# Altium project fmuvxX-baseT1.PrjPCB (part 3 of 3)

## Sheet 10_ethernet.SchDoc: =Proj_Title
size B; Date: 05/11/2022; CheckedBy: David Sidrane; Author: Dugan Yoon; Organization: © 2022 NXP; Address1: Giesshuebelstrasse 40; Address2: 8045 Zurich, Switzerland; DocumentNumber: 725001; Revision: 01; SheetNumber: 10; SheetTotal: 11
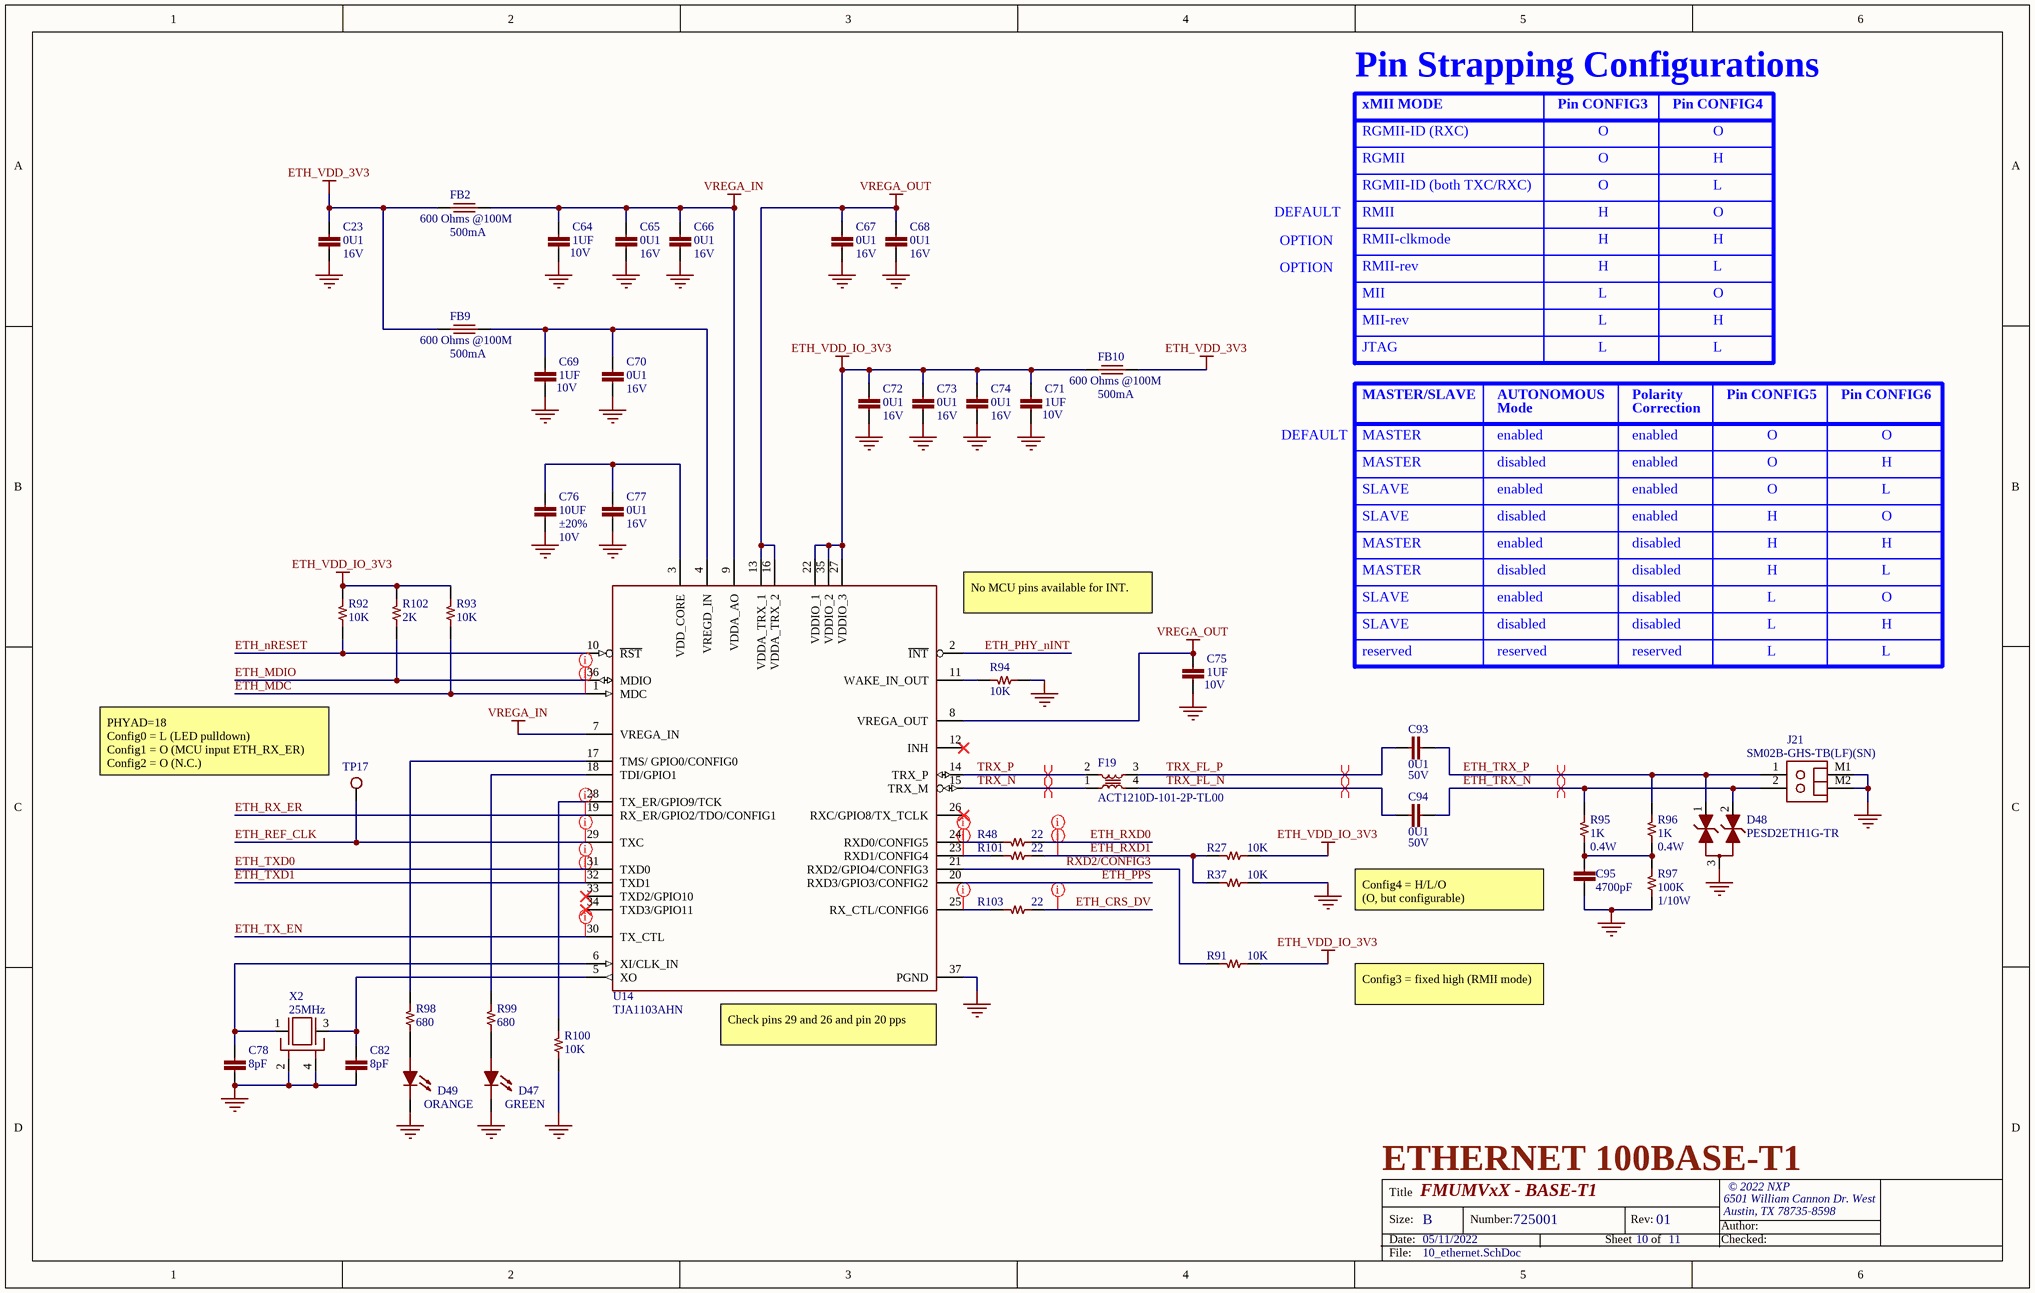
[diagram p6: 10_ethernet.SchDoc]

### Parts
C23  value 0U1  Voltage - Rated: 16V  [CAPC100X50X56L25N]  (hidden comment: CAP CER 0.1UF 10% 16V X7R 0402)
C64  value 1UF  Voltage - Rated: 10V  [CAPC100X50X56L25N]  (hidden comment: CAP CER 1UF 20% 10V X5R 0402)
C65  value 0U1  Voltage - Rated: 16V  [CAPC100X50X56L25N]  (hidden comment: CAP CER 0.1UF 10% 16V X7R 0402)
C66  value 0U1  Voltage - Rated: 16V  [CAPC100X50X56L25N]  (hidden comment: CAP CER 0.1UF 10% 16V X7R 0402)
C67  value 0U1  Voltage - Rated: 16V  [CAPC100X50X56L25N]  (hidden comment: CAP CER 0.1UF 10% 16V X7R 0402)
C68  value 0U1  Voltage - Rated: 16V  [CAPC100X50X56L25N]  (hidden comment: CAP CER 0.1UF 10% 16V X7R 0402)
C69  value 1UF  Voltage - Rated: 10V  [CAPC100X50X56L25N]  (hidden comment: CAP CER 1UF 20% 10V X5R 0402)
C70  value 0U1  Voltage - Rated: 16V  [CAPC100X50X56L25N]  (hidden comment: CAP CER 0.1UF 10% 16V X7R 0402)
C71  value 1UF  Voltage - Rated: 10V  [CAPC100X50X56L25N]  (hidden comment: CAP CER 1UF 20% 10V X5R 0402)
C72  value 0U1  Voltage - Rated: 16V  [CAPC100X50X56L25N]  (hidden comment: CAP CER 0.1UF 10% 16V X7R 0402)
C73  value 0U1  Voltage - Rated: 16V  [CAPC100X50X56L25N]  (hidden comment: CAP CER 0.1UF 10% 16V X7R 0402)
C74  value 0U1  Voltage - Rated: 16V  [CAPC100X50X56L25N]  (hidden comment: CAP CER 0.1UF 10% 16V X7R 0402)
C75  value 1UF  Voltage - Rated: 10V  [CAPC100X50X56L25N]  (hidden comment: CAP CER 1UF 20% 10V X5R 0402)
C76  value 10UF  Tolerance: ±20%  Voltage - Rated: 10V  [CAPC100X50X56L25N]  (hidden comment: CAP CER 10UF 20% 10V X5R 0402)
C77  value 0U1  Voltage - Rated: 16V  [CAPC100X50X56L25N]  (hidden comment: CAP CER 0.1UF 10% 16V X7R 0402)
C78  value 8pF  [CAPC100X50X56L25N]  (hidden comment: CAP CER 8PF 50V C0G/NP0 0402)
C82  value 8pF  [CAPC100X50X56L25N]  (hidden comment: CAP CER 8PF 50V C0G/NP0 0402)
C93  value 0U1  Voltage - Rated: 50V  [CAPC100X50X56L25N]  (hidden comment: CAP CER 0.1UF 10% 50V X7R 0402)
C94  value 0U1  Voltage - Rated: 50V  [CAPC100X50X56L25N]  (hidden comment: CAP CER 0.1UF 10% 50V X7R 0402)
C95  value 4700pF  [CAPC100X50X56L25N]  (hidden comment: CAP CER 4700PF 10% 50V X7R 0402)
D47  Color: GREEN  [LEDSC80X160X65L40N_GRN]  (hidden comment: LED GREEN CLEAR 0603 SMD)
D48  Manufacturer Part Number: PESD2ETH1G-TR  [SOT23-3P95_230X110L30X43N_GENERIC]  (hidden comment: DIODE TVS DUAL ETHERNET TO-236AB)
D49  Color: ORANGE  [LEDSC80X160X65L40N_ORA]  (hidden comment: LED ORANGE CLEAR 0603 SMD)
F19  Manufacturer Part Number: ACT1210D-101-2P-TL00  [TDK_ACT1210D]  (hidden comment: CMC 100uH 150mA 2LN 5.1KOHMS SMD)
FB2  value 600 Ohms @100M  Current: 500mA  [BEADC160X80X95L36N]  (hidden comment: IND FERRITE 600 OHMS @100M 500mA 0603)
FB9  value 600 Ohms @100M  Current: 500mA  [BEADC160X80X95L36N]  (hidden comment: IND FERRITE 600 OHMS @100M 500mA 0603)
FB10  value 600 Ohms @100M  Current: 500mA  [BEADC160X80X95L36N]  (hidden comment: IND FERRITE 600 OHMS @100M 500mA 0603)
J21  Manufacturer Part Number: SM02B-GHS-TB(LF)(SN)  [JST_SM02B-GHS-TBLFSN]  (hidden comment: CONN HEADER GH SIDE 2POS 1.25MM SMT)
R27  value 10K  [RESC100X50X40L25]  (hidden comment: RES SMD 10K OHM 1% 1/16W 0402)
R37  value 10K  [RESC100X50X40L25]  (hidden comment: RES SMD 10K OHM 1% 1/16W 0402)
R48  value 22  [RESC100X50X40L25]  (hidden comment: RES SMD 22 OHM 1% 1/16W 0402)
R91  value 10K  [RESC100X50X40L25]  (hidden comment: RES SMD 10K OHM 1% 1/16W 0402)
R92  value 10K  [RESC100X50X40L25]  (hidden comment: RES SMD 10K OHM 1% 1/16W 0402)
R93  value 10K  [RESC100X50X40L25]  (hidden comment: RES SMD 10K OHM 1% 1/16W 0402)
R94  value 10K  [RESC100X50X40L25]  (hidden comment: RES SMD 10K OHM 1% 1/16W 0402)
R95  value 1K  Power: 0.4W  [RESC200X125X70L40N]  (hidden comment: RES SMD 1K OHM 1% 0.4W 0805)
R96  value 1K  Power: 0.4W  [RESC200X125X70L40N]  (hidden comment: RES SMD 1K OHM 1% 0.4W 0805)
R97  value 100K  Power: 1/10W  [RESC1608X55L30N]  (hidden comment: RES 100K 1% 1/10W 0603)
R98  value 680  [RESC100X50X40L25]  (hidden comment: RES SMD 680 OHM 1% 1/16W 0402)
R99  value 680  [RESC100X50X40L25]  (hidden comment: RES SMD 680 OHM 1% 1/16W 0402)
R100  value 10K  [RESC100X50X40L25]  (hidden comment: RES SMD 10K OHM 1% 1/16W 0402)
R101  value 22  [RESC100X50X40L25]  (hidden comment: RES SMD 22 OHM 1% 1/16W 0402)
R102  value 2K  [RESC100X50X40L25]  (hidden comment: RES SMD 2K OHM 1% 1/16W 0402)
R103  value 22  [RESC100X50X40L25]  (hidden comment: RES SMD 22 OHM 1% 1/16W 0402)
TP17  TESTPOINT PAD SMD  [TEST_PAD_1MM]  (value not drawn)  (no BOM)
U14  Manufacturer Part Number: TJA1103AHN  [QFN37P50_600X600X85L55X24T390N]  (hidden comment: IC ETHERNET PHY 3.3/2.5/1.1V AEC-Q100 HVQFN36)
X2  Frequency: 25MHz  [OSCCC200X160X70L60X60]  (hidden comment: CRYSTAL 25.0000MHZ 6PF 4-SMD)

### Nets
ETH_VDD_3V3: C23.1 FB2.1 FB9.1 FB10.2
ETH_VDD_IO_3V3: C71.1 C72.1 C73.1 C74.1 FB10.1 R27.2 R91.2 R92.1 R93.1 R102.1 U14.22(VDDIO_1) U14.27(VDDIO_3) U14.35(VDDIO_2)
GND: C23.2 C64.2 C65.2 C66.2 C67.2 C68.2 C69.2 C70.2 C71.2 C72.2 C73.2 C74.2 C75.2 C76.2 C77.2 C78.2 C82.2 C95.2 D47.C D48.3 D49.C J21.M1 J21.M2 R37.2 R94.2 R97.2 R100.2 U14.37(PGND) X2.2 X2.4
VREGA_IN: C64.1 C65.1 C66.1 FB2.2 U14.7(VREGA_IN) U14.9(VDDA_AO)
VREGA_OUT: C67.1 C68.1 C75.1 U14.8(VREGA_OUT) U14.13(VDDA_TRX_1) U14.16(VDDA_TRX_2)
ETH_CRS_DV: R103.2
ETH_MDC: R93.2 U14.1(MDC)
ETH_MDIO: R102.2 U14.36(MDIO)
ETH_nRESET: R92.2 U14.10(~{RST})
ETH_PHY_nINT: U14.2(~{INT})
ETH_PPS: U14.20(RXD3/GPIO3/CONFIG2)
ETH_REF_CLK: TP17.1 U14.29(TXC)
ETH_RX_ER: U14.19(RX_ER/GPIO2/TDO/CONFIG1)
ETH_RXD0: R48.2
ETH_RXD1: R27.1 R37.1 R101.2
ETH_TRX_N: C94.2 D48.2 J21.2 R95.1
ETH_TRX_P: C93.2 D48.1 J21.1 R96.1
ETH_TX_EN: U14.30(TX_CTL)
ETH_TXD0: U14.31(TXD0)
ETH_TXD1: U14.32(TXD1)
RXD2/CONFIG3: R91.1 U14.21(RXD2/GPIO4/CONFIG3)
TRX_FL_N: C94.1 F19.4
TRX_FL_P: C93.1 F19.3
TRX_N: F19.1 U14.15(TRX_M)
TRX_P: F19.2 U14.14(TRX_P)
NetC69_1: C69.1 C70.1 FB9.2 U14.4(VREGD_IN)
NetC76_1: C76.1 C77.1 U14.3(VDD_CORE)
NetC78_1: C78.1 U14.6(XI/CLK_IN) X2.1
NetC82_1: C82.1 U14.5(XO) X2.3
NetC95_1: C95.1 R95.2 R96.2 R97.1
NetD47_A: D47.A R99.2
NetD49_A: D49.A R98.2
NetR48_1: R48.1 U14.24(RXD0/CONFIG5)
NetR94_1: R94.1 U14.11(WAKE_IN_OUT)
NetR98_1: R98.1 U14.17(TMS/_GPIO0/CONFIG0)
NetR99_1: R99.1 U14.18(TDI/GPIO1)
NetR100_1: R100.1 U14.28(TX_ER/GPIO9/TCK)
NetR101_1: R101.1 U14.23(RXD1/CONFIG4)
NetR103_1: R103.1 U14.25(RX_CTL/CONFIG6)

Not connected (* = marked no-connect by the designer): U14 12(INH)* 26(RXC/GPIO8/TX_TCLK)* 33(TXD2/GPIO10)* 34(TXD3/GPIO11)*

### Layout directives
differential pair: ETH_TRX_N, ETH_TRX_P, TRX_FL_N, TRX_FL_P, TRX_N, TRX_P
net class ETH: ETH_CRS_DV, ETH_MDC, ETH_MDIO, ETH_REF_CLK, ETH_RX_ER, ETH_RXD0, ETH_RXD1, ETH_TX_EN, ETH_TXD0, ETH_TXD1, NetR48_1, NetR101_1, NetR103_1

### Notes on the sheet
- Pin Strapping Configurations
- xMII MODE
- RGMII-ID (RXC)
- RGMII
- Pin CONFIG3
- O
- Pin CONFIG4
- H
- DEFAULT
- RGMII-ID (both TXC/RXC)
- RMII
- L
- OPTION
- RMII-clkmode
- RMII-rev
- MII
- MII-rev
- JTAG
- MASTER/SLAVE
- AUTONOMOUS
- Mode
- Polarity
- Correction
- Pin CONFIG5
- Pin CONFIG6
- MASTER
- SLAVE
- enabled
- disabled
- (near U14) No MCU pins available for INT.
- reserved
- (near TP17) PHYAD=18
  Config0 = L (LED pulldown)
  Config1 = O (MCU input ETH_RX_ER)
  Config2 = O (N.C.)
- Config4 = H/L/O
  (O, but configurable)
- (near U14) Check pins 29 and 26 and pin 20 pps
- Config3 = fixed high (RMII mode)
- ETHERNET 100BASE-T1
- Title
- Size:
- Date:
- B
- Number:
- Sheet
- Rev:
- of
- Author:
- Checked:
- File:

### Library data of the parts
C23 C65-C68 C70 C72-C74 C77 = CAP_0U1_16V_X7R_0402: Manufacturer: Murata Electronics; Manufacturer Part Number: GCM155R71C104KA55J; Packaging: Cut Tape (CT); Part Status: Active; Tolerance: ±10%; Operating Temperature: -55°C ~ 125°C; Supplier 1: Digi-Key; Supplier Part Number 1: 490-7998-1-ND; Category: Capacitors; Stock 1: 6381653; Pricing 1: 1=0.1, 10=0.049, 100=0.022, 500=0.0157, 1000=0.01233, 2500=0.01121, 5000=0.01032 (USD); ComponentLink1Description: https://www.digikey.com/product-detail/en/murata-electronics/GCM155R71C104KA55J/490-7998-1-ND/4380283; ComponentLink1URL: https://www.digikey.com/product-detail/en/murata-electronics/GCM155R71C104KA55J/490-7998-1-ND/4380283
C64 C69 C71 C75 = CAP_1UF_20%_10V_X5R_0402: Manufacturer: Yageo; Manufacturer Part Number: CC0402MRX5R6BB105; Packaging: Tape & Reel (TR); Part Status: Active; Temperature Coefficient: X5R; Operating Temperature: -55°C ~ 85°C; Ratings: -; Supplier 1: Digi-Key; Supplier Part Number 1: 311-1732-1-ND; Category: Capacitors; Stock 1: 52516; Pricing 1: 1=0.22, 10=0.156, 100=0.0732, 10000=0.02925 (USD); ComponentLink1Description: https://www.digikey.com/product-detail/en/yageo/CC0402MRX5R6BB105/311-1732-1-ND/5195634; ComponentLink1URL: https://www.digikey.com/product-detail/en/yageo/CC0402MRX5R6BB105/311-1732-1-ND/5195634; Tolerance: ±20%
C76 = CAP_10UF_20%_10V_X5R_0402: Manufacturer: Samsung Electro-Mechanics; Manufacturer Part Number: CL05A106MP5NUNC; Packaging: Tape & Reel (TR); Part Status: Active; Temperature Coefficient: X5R; Operating Temperature: -55°C ~ 85°C; Ratings: -; Supplier 1: Digi-Key; Supplier Part Number 1: 1276-1450-1-ND; Category: Capacitors; Stock 1: 0; Pricing 1: 1=0.53, 10=0.373, 100=0.23, 500=0.1761, 1000=0.15094, 2500=0.14375, 5000=0.13656 (USD); ComponentLink1Description: https://www.digikey.com/products/en?keywords=%091276-1450-1-ND; ComponentLink1URL: https://www.digikey.com/products/en?keywords=%091276-1450-1-ND
C78 C82 = CAP_8PF_50V_NPO_0402: Manufacturer: Yageo; Manufacturer Part Number: CC0402DRNPO9BN8R0; Temperature Coefficient: C0G, NP0; Tolerance: ±0.5pF; Packaging: Cut Tape (CT); Part Status: Active; Operating Temperature: -55°C ~ 125°C; Supplier 1: Digi-Key; Supplier Part Number 1: 311-1639-1-ND; Category: Capacitors; Stock 1: 455831; Pricing 1: 1=0.1, 10=0.032, 100=0.0143, 500=0.0102, 1000=0.00802, 2500=0.00729, 5000=0.0067 (USD); Voltage - Rated: 50V; ComponentLink1Description: https://www.digikey.com/product-detail/en/yageo/CC0402DRNPO9BN8R0/311-1639-1-ND/5195541; ComponentLink1URL: https://www.digikey.com/product-detail/en/yageo/CC0402DRNPO9BN8R0/311-1639-1-ND/5195541
C93 C94 = CAP_0U1_50V_X7R_0402: Manufacturer: TDK Corporation; Manufacturer Part Number: C1005X7R1H104K050BB; Packaging: Cut Tape (CT); Part Status: Active; Tolerance: ±10%; Operating Temperature: -55°C ~ 125°C; Supplier 1: Digi-Key; Supplier Part Number 1: 445-5932-1-ND; Category: Capacitors; Stock 1: 4733244; Pricing 1: 1=0.12 (USD); ComponentLink1Description: https://www.digikey.com/en/products/detail/tdk-corporation/C1005X7R1H104K050BB/2443410; ComponentLink1URL: https://www.digikey.com/en/products/detail/tdk-corporation/C1005X7R1H104K050BB/2443410
C95 = CAP_4700PF_5%_50V_X7R_0402: Manufacturer: Murata Electronics; Manufacturer Part Number: GRM155R71H472KA01J; Packaging: Cut Tape (CT); Part Status: Active; Temperature Coefficient: X7R; Operating Temperature: -55°C ~ 125°C; Ratings: -; Supplier 1: Digi-Key; Supplier Part Number 1: 490-8259-1-ND; Category: Capacitors; Stock 1: 457897; Pricing 1: 1=0.1, 10=0.011, 100=0.005, 500=0.00354, 1000=0.00278, 2500=0.00253, 5000=0.00233 (USD); Voltage - Rated: 50V; ComponentLink1Description: https://www.digikey.com/en/products/detail/murata-electronics/GRM155R71H472KA01J/2610945; ComponentLink1URL: https://www.digikey.com/en/products/detail/murata-electronics/GRM155R71H472KA01J/2610945; Tolerance: ±10%
D47 = DIODE_LED_GREEN_0603: Manufacturer: Lite-On Inc.; Manufacturer Part Number: LTST-C191KGKT; Packaging: Cut Tape (CT); Part Status: Active; ComponentLink1URL: http://optoelectronics.liteon.com/upload/download/DS22-2000-228/LTST-C191KGKT.PDF; ComponentLink1Description: http://optoelectronics.liteon.com/upload/download/DS22-2000-228/LTST-C191KGKT.PDF; Supplier 1: Digi-Key; Supplier Part Number 1: 160-1446-1-ND; Category: Optoelectronics; Stock 1: 2166001; Pricing 1: 1=0.34, 10=0.253, 25=0.1872, 100=0.1353 (USD); ComponentLink2Description: https://www.digikey.com/product-detail/en/lite-on-inc/LTST-C191KGKT/160-1446-1-ND/386834; ComponentLink2URL: https://www.digikey.com/product-detail/en/lite-on-inc/LTST-C191KGKT/160-1446-1-ND/386834
D48 = DIODE_TVS_DUAL_ETHERNET_TO236AB: Manufacturer: Nexperia USA Inc.; Packaging: Cut Tape (CT); Part Status: Active; Supplier 1: Digi-Key; Supplier Part Number 1: 1727-PESD2ETH1G-CT-ND; Category: Discrete Semiconductor Products; Stock 1: 0; Pricing 1: 1=0.40 (USD); ComponentLink1Description: https://www.digikey.com/en/products/detail/nexperia-usa-inc/PESD2ETH1G-TR/11487055?s=N4IgTCBcDaIA4FMDOATMCAuALAjAcwFoMQBdAXyA; ComponentLink1URL: https://www.digikey.com/en/products/detail/nexperia-usa-inc/PESD2ETH1G-TR/11487055?s=N4IgTCBcDaIA4FMDOATMCAuALAjAcwFoMQBdAXyA
D49 = DIODE_LED_ORANGE_0603: Manufacturer: Lite-On Inc.; Manufacturer Part Number: LTST-C191KFKT; Packaging: Cut Tape (CT); Part Status: Active; ComponentLink1URL: http://optoelectronics.liteon.com/upload/download/DS22-2000-228/LTST-C191KGKT.PDF; ComponentLink1Description: http://optoelectronics.liteon.com/upload/download/DS22-2000-228/LTST-C191KGKT.PDF; Supplier 1: Digi-Key; Supplier Part Number 1: 160-1445-1-ND; Category: Optoelectronics; Stock 1: 146932; Pricing 1: 1=0.34, 10=0.253, 25=0.1872, 100=0.1353 (USD); ComponentLink2Description: https://www.digikey.com/product-detail/en/lite-on-inc/LTST-C191KFKT/160-1445-1-ND/386832; ComponentLink2URL: https://www.digikey.com/product-detail/en/lite-on-inc/LTST-C191KFKT/160-1445-1-ND/386832
F19 = FILTER_CMC_100uH_150mA_2LN_SMD: Manufacturer: TDK Corporation; Voltage - Rated: 5V; Packaging: Cut Tape (CT); Part Status: Active; Operating Temperature: -55°C ~ 150°C; Supplier 1: Digi-Key; Supplier Part Number 1: 445-ACT1210D-101-2P-TL00CT-ND; Category: Filters; Stock 1: 9046; Pricing 1: 1=1.88 (USD); Current - Rated: 150mA; ComponentLink1Description: https://www.digikey.com/en/products/detail/tdk-corporation/act1210d-101-2p-tl00/13672016; ComponentLink1URL: https://www.digikey.com/en/products/detail/tdk-corporation/act1210d-101-2p-tl00/13672016
FB2 FB9 FB10 = IND_FERRITE_600OHM@100M_500mA_0603: Manufacturer: Murata Electronics North America; Manufacturer Part Number: BLM18AG601BH1D; Packaging: Cut Tape (CT); Part Status: Active; Operating Temperature: -55°C ~ 150°C; Supplier 1: Digi-Key; Supplier Part Number 1: 490-7809-1-ND; Category: Inductors; Stock 1: 39046; Pricing 1: 1=0.12 (USD); ComponentLink1Description: https://www.digikey.com/en/products/detail/murata-electronics/BLM18AG601BH1D/6156010?s=N4IgTCBcDaIEYBsC2BGAHAQwOYDYAMKcAFigCYgC6AvkA; ComponentLink1URL: https://www.digikey.com/en/products/detail/murata-electronics/BLM18AG601BH1D/6156010?s=N4IgTCBcDaIEYBsC2BGAHAQwOYDYAMKcAFigCYgC6AvkA
J21 = CONN_JST_GH_2PIN_RA_SMT: Manufacturer: JST Sales America Inc.; Voltage - Rated: 50V; System: Connector; Packaging: Cut Tape (CT); Part Status: Active; Operating Temperature: -25°C ~ 85°C; Supplier 1: Digi-Key; Category: Connectors, Interconnects; Stock 1: 90823; Pricing 1: 1=0.44, 10=0.413, 100=0.316, 500=0.27502, 1000=0.22689 (USD); Supplier Part Number 1: 455-1564-1-ND; ComponentLink1Description: https://www.digikey.com/products/en/connectors-interconnects/rectangular-connectors-headers-male-pins/314?k=sm02b&k=&pkeyword=sm02b&sv=0&pv7=2&s=2395&pv1989=0&sf=0&FV=ffe0013a&quantity=&ColumnSort=0&page=1&pageSize=25; ComponentLink1URL: https://www.digikey.com/products/en/connectors-interconnects/rectangular-connectors-headers-male-pins/314?k=sm02b&k=&pkeyword=sm02b&sv=0&pv7=2&s=2395&pv1989=0&sf=0&FV=ffe0013a&quantity=&ColumnSort=0&page=1&pageSize=25
R27 R37 R91-R94 R100 = RES_10K_1%_1/16W_0402: Manufacturer: Vishay Dale; Manufacturer Part Number: CRCW040210K0FKED; Packaging: Cut Tape (CT); Part Status: Active; Tolerance: ±1%; Operating Temperature: -55°C ~ 155°C; ComponentLink1URL: https://www.digikey.com/products/en?keywords=311-10.0KLRCT-ND; ComponentLink1Description: https://www.digikey.com/products/en?keywords=311-10.0KLRCT-ND; Supplier 1: Digi-Key; Supplier Part Number 1: 541-10.0KLCT-ND; Category: Resistors; Stock 1: 37996194; Pricing 1: 1=0.1, 10=0.014, 100=0.0056, 1000=0.00253, 2500=0.0022, 5000=0.00181 (USD); Power: 1/16W
R48 R101 R103 = RES_22R_1%_1/16W_0402: Manufacturer: Yageo; Manufacturer Part Number: RC0402FR-0722RL; Category: Resistors; Packaging: Cut Tape (CT); Part Status: Active; Tolerance: ±1%; Operating Temperature: -55°C ~ 155°C; Supplier 1: Digi-Key; Stock 1: 24406416; Pricing 1: 1=0.1, 10=0.014, 100=0.0056, 1000=0.00253, 2500=0.0022, 5000=0.00181 (USD); Power: 1/16W; Supplier Part Number 1: 311-22.0LRCT-ND; ComponentLink1Description: https://www.digikey.com/product-detail/en/yageo/RC0402FR-0722RL/311-22.0LRCT-ND/729509; ComponentLink1URL: https://www.digikey.com/product-detail/en/yageo/RC0402FR-0722RL/311-22.0LRCT-ND/729509
R95 R96 = RES_1K_1%_0.4W_0805: Manufacturer: Rohm Semiconductor; Manufacturer Part Number: ESR10EZPF1001; Packaging: Cut Tape (CT); Part Status: Active; Tolerance: ±1%; Operating Temperature: -55°C ~ 155°C; Supplier 1: Digi-Key; Supplier Part Number 1: RHM1.00KAECT-ND; Category: Resistors; Stock 1: 368234; Pricing 1: 1=0.18 (USD); ComponentLink1Description: https://www.digikey.com/en/products/detail/rohm-semiconductor/ESR10EZPF1001/1983480; ComponentLink1URL: https://www.digikey.com/en/products/detail/rohm-semiconductor/ESR10EZPF1001/1983480
R97 = RES_100K_1%_1/10W_0603: Manufacturer: Yageo; Manufacturer Part Number: RC0603FR-07100KL; Packaging: Digi-Reel®; Part Status: Active; Tolerance: ±1%; Operating Temperature: -55°C ~ 155°C; ComponentLink1URL: http://www.yageo.com/documents/recent/PYu-RC_Group_51_RoHS_L_7.pdf; ComponentLink1Description: http://www.yageo.com/documents/recent/PYu-RC_Group_51_RoHS_L_7.pdf; Supplier 1: Digi-Key; Supplier Part Number 1: 311-100KHRDKR-ND; Category: Resistors; Stock 1: 10050286; Pricing 1: 1=0.1, 10=0.015, 100=0.006, 1000=0.00268, 2500=0.00233 (USD)
R98 R99 = RES_680_1%_1/16W_0402: Manufacturer: Yageo; Manufacturer Part Number: AC0402FR-07680RL; Packaging: Cut Tape (CT); Part Status: Active; Tolerance: ±1%; Operating Temperature: -55°C ~ 155°C; Supplier 1: Digi-Key; Supplier Part Number 1: YAG3505CT-ND; Category: Resistors; Stock 1: 97012; Pricing 1: 1=0.1, 10=0.014, 100=0.0056, 1000=0.00253, 2500=0.0022, 5000=0.00181 (USD); Power: 1/16W; ComponentLink1Description: https://www.digikey.com/en/products/detail/yageo/AC0402FR-07680RL/5895472; ComponentLink1URL: https://www.digikey.com/en/products/detail/yageo/AC0402FR-07680RL/5895472
R102 = RES_2K_1%_1/16W_0402: Manufacturer: Yageo; Manufacturer Part Number: RC0402FR-072KL; Packaging: Cut Tape (CT); Part Status: Active; Tolerance: ±1%; Operating Temperature: -55°C ~ 155°C; Supplier 1: Digi-Key; Supplier Part Number 1: 311-2KLRCT-ND; Category: Resistors; Stock 1: 18685853; Pricing 1: 1=0.1, 10=0.014, 100=0.0056, 1000=0.00253, 2500=0.0022, 5000=0.00181 (USD); Power: 1/16W; ComponentLink1Description: https://www.digikey.com/product-detail/en/yageo/RC0402FR-072KL/311-2KLRCT-ND/2827883; ComponentLink1URL: https://www.digikey.com/product-detail/en/yageo/RC0402FR-072KL/311-2KLRCT-ND/2827883
TP17 = TESTPOINT_PAD_SMD: CATEGORY: Test and Measurement; Manufacturer: N/A
U14 = IC_TJA1103A_ETHERNET_HVQFN36: Manufacturer: NXP SEMICONDUCTORS; Packaging: Cut Tape (CT); Part Status: Active; Operating Temperature: -40°C ~ 125°C; Supplier 1: Digi-Key; Category: Integrated Circuits (ICs); Stock 1: 0; Pricing 1: 1=TBD (USD)
X2 = XTAL_25.0000MHZ_6PF_4-SMD: Manufacturer: Murata Electronics; Manufacturer Part Number: XRCGB25M000F3A00R0; Frequency Stability: ±35ppm; Packaging: Cut Tape (CT); Part Status: Active; Frequency Tolerance: ±35ppm; Load Capacitance: 6pF; Operating Temperature: -40°C ~ 125°C; Supplier 1: Digi-Key; Supplier Part Number 1: 490-12146-1-ND; Category: Crystals, Oscillators, Resonators; Stock 1: 4510; Pricing 1: 1=0.55 (USD); ComponentLink1Description: https://www.digikey.com/en/products/detail/murata-electronics/XRCGB25M000F3A00R0/5403569?s=N4IgTCBcDaIB4CcDGBzARmArAWwAz4DMBmAQ3wVxAF0BfIA; ComponentLink1URL: https://www.digikey.com/en/products/detail/murata-electronics/XRCGB25M000F3A00R0/5403569?s=N4IgTCBcDaIB4CcDGBzARmArAWwAz4DMBmAQ3wVxAF0BfIA

## Nets that join several sheets
ETH_VDD_3V3: 08_power (C54.1 C55.1 U12.7), 10_ethernet (C23.1 FB2.1 FB9.1 FB10.2)
FMU_VDD_3V3: 02_PAB (J1.84 J1.86 J23.1 R1.1), 05_can_spi (FB3.1 FB5.1 FB7.1 R43.1), 08_power (R77.1 R83.1)
GND: 02_PAB (48 pins), 03_io_mcu (36 pins), 05_can_spi (58 pins), 08_power (39 pins), 09_servo (26 pins), 10_ethernet (30 pins)
IO_VDD_3V3: 03_io_mcu (11 pins), 08_power (C47.1 C48.1 U10.7)
IO_VDD_5V: 03_io_mcu (D3.A D4.A D5.A), 08_power (5 pins)
V_RTC_BAT: 02_PAB (J1.29), 03_io_mcu (U1.1)
VDD_5V_IN: 02_PAB (J1.49 J1.51 J1.53 J1.55), 08_power (8 pins)
VDD_5V_PERIPH: 05_can_spi (8 pins), 08_power (C58.1 C59.1 U13.8)
VDD_SERVO: 03_io_mcu (R4.1), 09_servo (18 pins)
CAN1_RX: 02_PAB (J1.65), 05_can_spi (U2.4)
CAN1_TX: 02_PAB (J1.63), 05_can_spi (U2.1)
CAN2_RX: 02_PAB (J1.59), 05_can_spi (U15.4)
CAN2_TX: 02_PAB (J1.57), 05_can_spi (U15.1)
CAN3_RX: 02_PAB (J22.42), 05_can_spi (U3.4)
CAN3_TX: 02_PAB (J22.40), 05_can_spi (U3.1)
ETH_CRS_DV: 02_PAB (J22.7), 10_ethernet (R103.2)
ETH_MDC: 02_PAB (J22.4), 10_ethernet (R93.2 U14.1)
ETH_MDIO: 02_PAB (J22.2), 10_ethernet (R102.2 U14.36)
ETH_nRESET: 08_power (U12.3), 10_ethernet (R92.2 U14.10)
ETH_PHY_nINT: 02_PAB (J22.12), 10_ethernet (U14.2)
ETH_POWER_EN: 02_PAB (J22.6), 08_power (R82.2 U12.4)
ETH_PPS: 02_PAB (R113.1), 10_ethernet (U14.20)
ETH_REF_CLK: 02_PAB (J22.3), 10_ethernet (TP17.1 U14.29)
ETH_RX_ER: 02_PAB (J22.10), 10_ethernet (U14.19)
ETH_RXD0: 02_PAB (J22.11), 10_ethernet (R48.2)
ETH_RXD1: 02_PAB (J22.15), 10_ethernet (R27.1 R37.1 R101.2)
ETH_TX_EN: 02_PAB (J22.27), 10_ethernet (U14.30)
ETH_TXD0: 02_PAB (J22.19), 10_ethernet (U14.31)
ETH_TXD1: 02_PAB (J22.23), 10_ethernet (U14.32)
FMU_CH1: 02_PAB (J1.17), 09_servo (R88.4)
FMU_CH2: 02_PAB (J1.15), 09_servo (R88.3)
FMU_CH3: 02_PAB (J1.13), 09_servo (R88.2)
FMU_CH4: 02_PAB (J1.11), 09_servo (R88.1)
FMU_CH5: 02_PAB (J1.7), 09_servo (R87.4)
FMU_CH6: 02_PAB (J1.5), 09_servo (R87.3)
FMU_CH7: 02_PAB (J1.3), 09_servo (R87.2)
FMU_CH8: 02_PAB (J1.1), 09_servo (R87.1)
IO_CH1: 03_io_mcu (U1.10), 09_servo (R90.4)
IO_CH2: 03_io_mcu (U1.11), 09_servo (R90.3)
IO_CH3: 03_io_mcu (U1.45), 09_servo (R90.2)
IO_CH4: 03_io_mcu (U1.46), 09_servo (R90.1)
IO_CH5: 03_io_mcu (U1.16), 09_servo (R89.4)
IO_CH6: 03_io_mcu (U1.17), 09_servo (R89.3)
IO_CH7: 03_io_mcu (U1.18), 09_servo (R89.2)
IO_CH8: 03_io_mcu (U1.19), 09_servo (R89.1)
IO_nRST: 03_io_mcu (6 pins), 08_power (U10.3)
IO_VDD_3V3_SPEKTRUM_EN: 03_io_mcu (U1.2), 08_power (R76.2 R78.1 U10.5)
SPI4_DRDY1_EXTERNAL1: 02_PAB (J22.47), 05_can_spi (R106.1)
SPI4_MISO_EXTERNAL1: 02_PAB (J22.31), 05_can_spi (R40.1)
SPI4_MOSI_EXTERNAL1: 02_PAB (J22.33), 05_can_spi (R41.1)
SPI4_nCS1_EXTERNAL1: 02_PAB (J22.41), 05_can_spi (R42.1)
SPI4_nRESET_EXTERNAL1: 02_PAB (J22.39), 05_can_spi (R45.1)
SPI4_SCK_EXTERNAL1: 02_PAB (D54.5 D54.6 J22.35 J23.6), 05_can_spi (R39.1)
SPIX_SYNC: 02_PAB (J22.49), 05_can_spi (Q2.G)
USART6_RX_FROM_IO__NC: 02_PAB (J1.70), 03_io_mcu (R5.2)
USART6_TX_FROM_IO__RC_INPUT: 02_PAB (J1.72), 03_io_mcu (R6.2)
VDD_3V3_SPEKTRUM_POWER_EN: 02_PAB (J1.33), 08_power (R76.1)
VDD_5V_HIPOWER_nEN: 02_PAB (J1.81), 08_power (R80.2)
VDD_5V_HIPOWER_nOC: 02_PAB (J1.83), 08_power (R79.2)
VDD_5V_PERIPH_nEN: 02_PAB (J1.35), 08_power (R85.2)
VDD_5V_PERIPH_nOC: 02_PAB (J1.37), 08_power (R84.2)

## Assembly variants
Production: not fitted C? C? C? C? C? C? C? C? C? C? R1 R1 R2 R2 R59 R? R? R? R? R? R? R? R? R?